# EAGLE design Lumiboard - main board (rev C) (EAGLE 6.5.0)
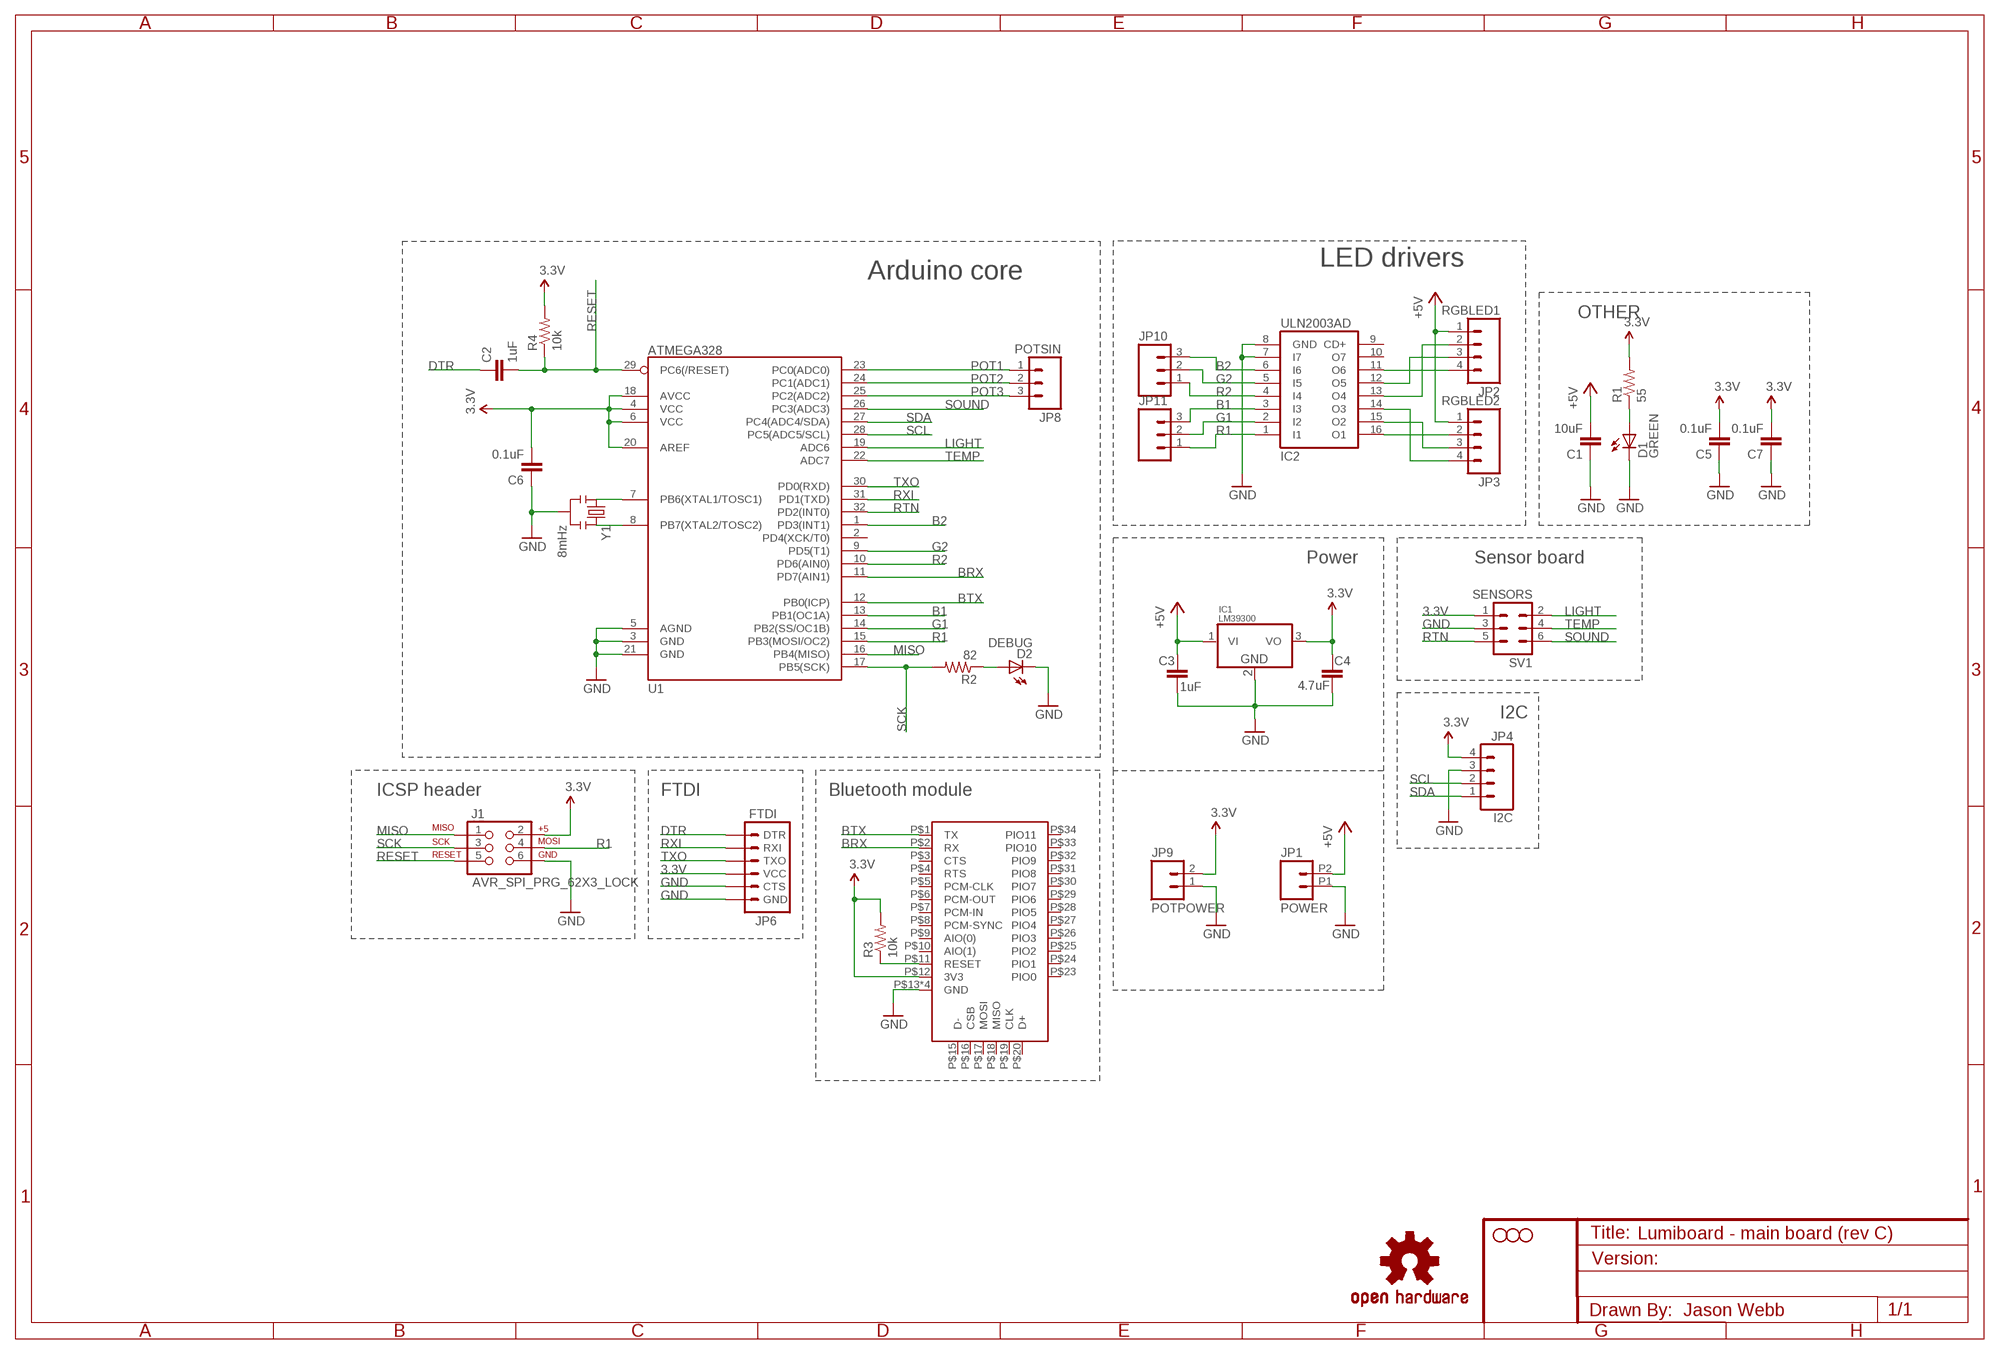
[diagram p0: schematic, sheet 1]

## Parts
C1  10uF  CAP0805  [0805]
C2  1uF  CAP0805  [0805]
C3  1uF  CAP0805  [0805]
C4  4.7uF  CAP0805  [0805]
C5  0.1uF  CAP0805  [0805]
C6  0.1uF  CAP0805  [0805]
C7  0.1uF  CAP0805  [0805]
D1  GREEN  LEDCHIPLED_0805  [CHIPLED_0805]
D2  DEBUG  LEDCHIPLED_0805  [CHIPLED_0805]
H1  STAND-OFFTIGHT  [STAND-OFF-TIGHT]
H2  STAND-OFFTIGHT  [STAND-OFF-TIGHT]
H3  STAND-OFFTIGHT  [STAND-OFF-TIGHT]
IC1  LM39300  [DPAK]
IC2  ULN2003AD  [SO16]
J1  AVR_SPI_PRG_62X3_LOCK  [2X3_LOCK]
JP1  POWER  M022.54MM_SCREWTERM  [1X02_2.54_SCREWTERM]
JP2  RGBLED1  M04PTH  [1X04]
JP3  RGBLED2  M04PTH  [1X04]
JP4  I2C  M04PTH  [1X04]
JP6  FTDI  ARDUINO_SERIAL_PROGRAMLOCK  [1X06_LOCK]
JP8  POTSIN  M03PTH  [1X03]
JP9  POTPOWER  M02PTH  [1X02]
JP10  M03PTH  [1X03]
JP11  M03PTH  [1X03]
LOGO1  OSHW-LOGOS  [OSHW-LOGO-S]
R1  55  RESISTOR0805-RES  [0805]
R2  82  RESISTOR0805-RES  [0805]
R3  10k  RESISTOR0805-RES  [0805]
R4  10k  RESISTOR0805-RES  [0805]
SV1  SENSORS  ML6  [ML6]
U1  ATMEGA328  ATMEGA168  [TQFP32-08]
U2  DX_BT_MODULE  [DXBLUETOOTHMODULE]
Y1  8mHz  RESONATORSMD  [RESONATOR-SMD]

## Nets
3.3V: C4.2 C5.2 C6.2 C7.2 IC1.3(VO) J1.2 JP4.4 JP6.4(VCC) JP9.2 R1.2 R3.2 R4.2 SV1.1 U1.4(VCC) U1.6(VCC) U1.18(AVCC) U1.20(AREF) U2.P$12(3V3)
+5V: C1.2 C3.2 IC1.1(VI) JP1.P2 JP2.1 JP3.1
B1: IC2.3(I3) JP11.3 U1.13(PB1(OC1A))
B2: IC2.6(I6) JP10.3 U1.1(PD3(INT1))
BRX: U1.11(PD7(AIN1)) U2.P$2(RX)
BTRESET: R3.1 U2.P$11(RESET)
BTX: U1.12(PB0(ICP)) U2.P$1(TX)
DTR: C2.1 JP6.1(DTR)
G1: IC2.2(I2) JP11.2 U1.14(PB2(SS/OC1B))
G2: IC2.5(I5) JP10.2 U1.9(PD5(T1))
GND: C1.1 C3.1 C4.1 C5.1 C6.1 C7.1 D1.C D2.C IC1.2(GND) IC2.7(I7) IC2.8(GND) J1.6 JP1.P1 JP4.3 JP6.5(CTS) JP6.6(GND) JP9.1 SV1.3 U1.3(GND) U1.5(AGND) U1.21(GND) U2.P$13(GND) U2.P$14(GND) U2.P$21(GND) U2.P$22(GND) Y1.2
LIGHT: SV1.2 U1.19(ADC6)
MISO: J1.1 U1.16(PB4(MISO))
N$1: IC2.16(O1) JP3.2
N$3: IC2.15(O2) JP3.3
N$4: IC2.13(O4) JP2.2
N$5: IC2.14(O3) JP3.4
N$6: IC2.12(O5) JP2.3
N$7: U1.7(PB6(XTAL1/TOSC1)) Y1.1
N$8: U1.8(PB7(XTAL2/TOSC2)) Y1.3
N$9: D1.A R1.1
N$10: IC2.11(O6) JP2.4
N$13: D2.A R2.1
POT1: JP8.1 U1.23(PC0(ADC0))
POT2: JP8.2 U1.24(PC1(ADC1))
POT3: JP8.3 U1.25(PC2(ADC2))
R1: IC2.1(I1) J1.4 JP11.1 U1.15(PB3(MOSI/OC2))
R2: IC2.4(I4) JP10.1 U1.10(PD6(AIN0))
RESET: C2.2 J1.5 R4.1 U1.29(PC6(/RESET))
RTN: SV1.5 U1.32(PD2(INT0))
RXI: JP6.2(RXI) U1.31(PD1(TXD))
SCK: J1.3 R2.2 U1.17(PB5(SCK))
SCL: JP4.2 U1.28(PC5(ADC5/SCL))
SDA: JP4.1 U1.27(PC4(ADC4/SDA))
SOUND: SV1.6 U1.26(PC3(ADC3))
TEMP: SV1.4 U1.22(ADC7)
TXO: JP6.3(TXO) U1.30(PD0(RXD))
Unconnected: IC2.9(CD+) IC2.10(O7) U1.2(PD4(XCK/T0)) U2.P$3(CTS) U2.P$4(RTS) U2.P$5(PCM-CLK) U2.P$6(PCM-OUT) U2.P$7(PCM-IN) U2.P$8(PCM-SYNC) U2.P$9(AIO(0)) U2.P$10(AIO(1)) U2.P$15(D-) U2.P$16(CSB) U2.P$17(MOSI) U2.P$18(MISO) U2.P$19(CLK) U2.P$20(D+) U2.P$23(PIO0) U2.P$24(PIO1) U2.P$25(PIO2) U2.P$26(PIO3) U2.P$27(PIO4) U2.P$28(PIO5) U2.P$29(PIO6) U2.P$30(PIO7) U2.P$31(PIO8) U2.P$32(PIO9) U2.P$33(PIO10) U2.P$34(PIO11)

## Notes on the sheet
- LED drivers
- Arduino core
- OTHER
- Power | Sensor board
- I2C
- ICSP header | FTDI | Bluetooth module
- Jason Webb

## Library data of the parts
C1-C7 = SparkFun:CAP: Capacitor Standard 0603 ceramic capacitor, and 0.1" leaded capacitor.
D1 D2 = led:LED: LED OSRAM: - CHIPLED LG R971, LG N971, LY N971, LG Q971, LY Q971, LO R971, LY R971 LH N974, LH R974 LS Q976, LO Q976, LY Q976 LO Q996 - Hyper CHIPLED LW Q18S LB Q993, LB Q99A, LB R99A - SideLED LS A670, LO A670, LY A670, LG A670, LP A670 LB A673, LV A673, LT A673, LW A673 LH A674 LY A675 LS A676, LA A676, LO A676, LY A676, LW A676 LS A679, LY A679, LG A679 - Hyper Micro SIDELED® LS Y876, LA Y876, LO Y876, LY Y876 LT Y87S - SmartLED LW L88C, LW L88S LB L89C, LB L89S, LG L890 LS L89K, LO L89K, LY L89K LS L896, LA L896, LO L896, LY L896 - TOPLED LS T670, LO T670, LY T670, LG T670, LP T670 LSG T670, LSP T670, LSY T670, LOP T670, LYG T670 LG T671, LOG T671, LSG T671 LB T673, LV T673, LT T673, LW T673 LH T674 LS T676, LA T676, LO T676, LY T676, LB T676, LH T676, LSB T676, LW T676 LB T67C, LV T67C, LT T67C, LS T67K, LO T67K, LY T67K, LW E67C LS E67B, LA E67B, LO E67B, LY E67B, LB E67C, LV E67C, LT E67C LW T67C LS T679, LY T679, LG T679 LS T770, LO T770, LY T770, LG T770, LP T770 LB T773, LV T773, LT T773, LW T773 LH T774 LS E675, LA E675, LY E675, LS T675 LS T776, LA T776, LO T776, LY T776, LB T776 LHGB T686 LT T68C, LB T68C - Hyper Mini TOPLED® LB M676 - Mini TOPLED Santana® LG M470 LS M47K, LO M47K, LY M47K Source: http://www.osram.convergy.de LUXEON: - LUMILED® LXK2-PW12-R00, LXK2-PW12-S00, LXK2-PW14-U00, LXK2-PW14-V00 LXK2-PM12-R00, LXK2-PM12-S00, LXK2-PM14-U00 LXK2-PE12-Q00, LXK2-PE12-R00, LXK2-PE12-S00, LXK2-PE14-T00, LXK2-PE14-U00 LXK2-PB12-K00, LXK2-PB12-L00, LXK2-PB12-M00, LXK2-PB14-N00, LXK2-PB14-P00, LXK2-PB14-Q00 LXK2-PR12-L00, LXK2-PR12-M00, LXK2-PR14-Q00, LXK2-PR14-R00 LXK2-PD12-Q00, LXK2-PD12-R00, LXK2-PD12-S00 LXK2-PH12-R00, LXK2-PH12-S00 LXK2-PL12-P00, LXK2-PL12-Q00, LXK2-PL12-R00 Source: www.luxeon.com KINGBRIGHT: KA-3528ASYC Source: www.kingbright.com
H1-H3 = SparkFun:STAND-OFF: Stand Off This is the mechanical footprint for a #4 phillips button head screw. Use the keepout ring to avoid running the screw head into surrounding components. SKU : PRT-00447
IC1 = LM39300:LM39300
IC2 = uln-udn:ULN2003A: DRIVER ARRAY
J1 = SparkFun-Connectors:AVR_SPI_PRG_6: AVR ISP 6 Pin This is the reduced ISP connector for AVR programming. Common on Arduino. This footprint will take up less PCB space and can be used with a 10-pin to 6-pin adapter such as SKU: BOB-08508
JP1 = SparkFun-Connectors:M02: Standard 2-pin 0.1" header. Use with - straight break away headers ( PRT-00116) - right angle break away headers (PRT-00553) - swiss pins (PRT-00743) - machine pins (PRT-00117) - female headers (PRT-00115) Molex polarized connector foot print use with: PRT-08233 with associated crimp pins and housings. 2.54_SCREWTERM for use with PRT-10571. 3.5mm Screw Terminal footprints for PRT-08084 5mm Screw Terminal footprints for use with PRT-08433
JP2-JP4 = SparkFun-Connectors:M04: Header 4 Standard 4-pin 0.1" header. Use with straight break away headers (SKU : PRT-00116), right angle break away headers (PRT-00553), swiss pins (PRT-00743), machine pins (PRT-00117), and female headers (PRT-00115). Molex polarized connector foot print use with SKU : PRT-08231 with associated crimp pins and housings. 1MM SMD Version SKU: PRT-10208
JP6 = SparkFun:ARDUINO_SERIAL_PROGRAM
JP8 = SparkFun:M03: Header 3 Standard 3-pin 0.1" header. Use with straight break away headers (SKU : PRT-00116), right angle break away headers (PRT-00553), swiss pins (PRT-00743), machine pins (PRT-00117), and female headers (PRT-00115). Molex polarized connector foot print use with SKU : PRT-08232 with associated crimp pins and housings.
JP9 = SparkFun:M02: Header 2 Standard 2-pin 0.1" header. Use with straight break away headers (SKU : PRT-00116), right angle break away headers (PRT-00553), swiss pins (PRT-00743), machine pins (PRT-00117), and female headers (PRT-00115). Molex polarized connector foot print use with SKU : PRT-08233 with associated crimp pins and housings.
JP10 JP11 = SparkFun-Connectors:M03: Header 3 Standard 3-pin 0.1" header. Use with straight break away headers (SKU : PRT-00116), right angle break away headers (PRT-00553), swiss pins (PRT-00743), machine pins (PRT-00117), and female headers (PRT-00115). Molex polarized connector foot print use with SKU : PRT-08232 with associated crimp pins and housings.
LOGO1 = SparkFun-Aesthetics:OSHW-LOGO: Open Source Hardware Logo This logo indicates the piece of hardware it is found on incorporates a OSHW license and/or adheres to the definition of open source hardware found here: http://freedomdefined.org/OSHW
R1-R4 = SparkFun-Resistors:RESISTOR: Resistor Basic schematic elements and footprints for 0603, 1206, and PTH resistors.
SV1 = con-harting-ml:ML6: HARTING; OC_FARNELL: unknown; OC_NEWARK: unknown
U1 = SparkFun:ATMEGA168
U2 = Richardson:DX_BT_MODULE: http://www.dealextreme.com/p/wireless-bluetooth-rs232-ttl-transceiver-module-80711
Y1 = SparkFun:RESONATOR: Resonator Small SMD resonator. This is the itty bitty 10/20MHz resonators with built in caps. CSTCE10M0G55 and CSTCE20M0V53. Footprint has been reviewed closely but hasn't been tested yet.

## Net classes
0 Power: width 0.254 mm, drill 0.305 mm, clearance 0.203 mm

## Board
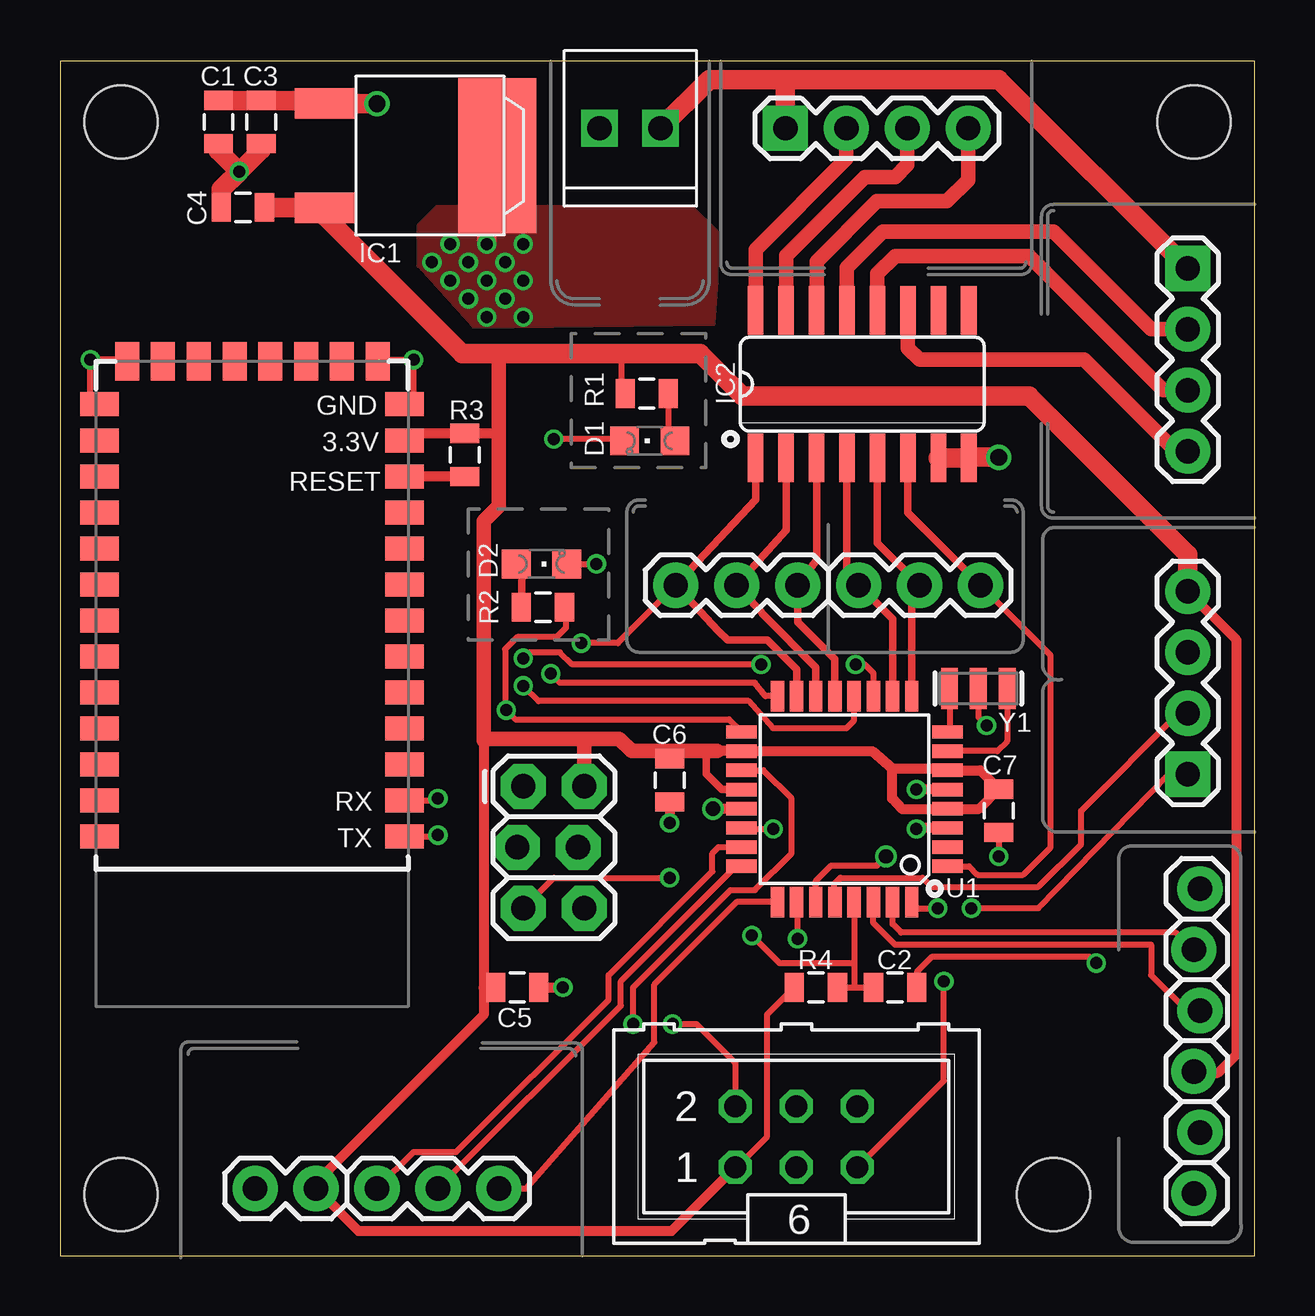
[diagram p1: board, top side]
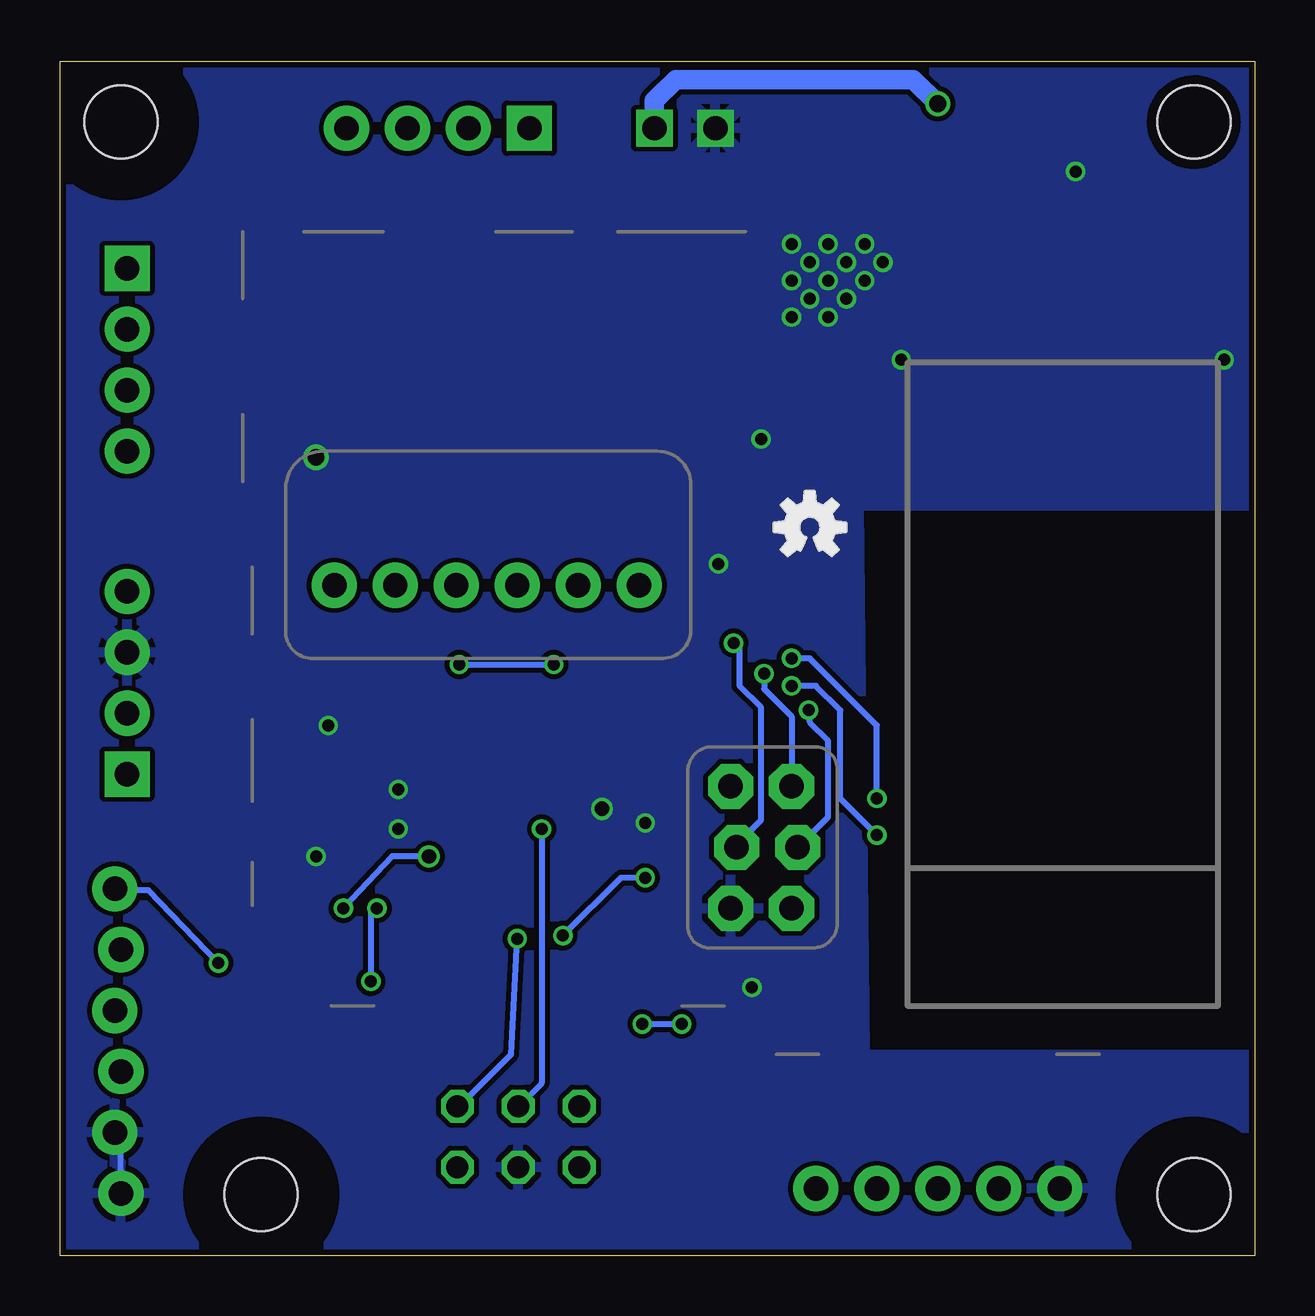
[diagram p2: board, bottom side, seen from below]

Size 49.78 x 49.78 mm. Coordinates in mm from the lower left corner, seen from the top.
Outline: 0,0 49.78,0 49.78,49.78 0,49.78 0,0
Copper layers (1*2*15*16): Top 0.035mm / dielectric 0.2mm / Route2 0.0175mm / dielectric 1.1mm / Route15 0.0175mm / dielectric 0.2mm / Bottom 0.035mm
Design rules "SeeedStudio_DRU_no_angle_20130527": minimum track width 6mil, minimum drill 12mil, track to track 6mil, track to pad 6mil, pad to pad 6mil, via to via 6mil, smd to smd 0mil, copper to edge 10mil, drill to drill 10mil, minimum pad ring 6mil, minimum via ring 6mil, stop-mask expansion 2mil, vias tented up to drill 25mil, thermal gap 10mil
tRestrict: area -0.6,-0.6 to 5.7,5.7; area 38.2,-0.6 to 44.6,5.7; area 44.1,44.1 to 50.4,50.4
bRestrict: area -0.6,-0.6 to 5.7,5.7; area 38.2,-0.6 to 44.6,5.7; area 44.1,44.1 to 50.4,50.4

### Footprints (pad centres in the part's own frame; a part is rotated, then mirrored left to right if it is on the bottom)
0805 = smd 0.8 x 1.2: 1 -0.9,0; 2 0.9,0
CHIPLED_0805 = smd 1.2 x 1.2: A 0,-1.05; C 0,1.05
STAND-OFF-TIGHT = hole 3.048: 0,0
DPAK = smd 1.27 x 2.54: 1 -2.057,-4.445; 3 2.311,-4.445 | smd 6.452 x 3.251: 2 0.127,2.718
SO16 = smd 0.66 x 2.032: 1 -4.445,-3.073; 2 -3.175,-3.073; 3 -1.905,-3.073; 4 -0.635,-3.073; 5 0.635,-3.073; 6 1.905,-3.073; 7 3.175,-3.073; 8 4.445,-3.073; 9 4.445,3.073; 10 3.175,3.073; 11 1.905,3.073; 12 0.635,3.073; 13 -0.635,3.073; 14 -1.905,3.073; 15 -3.175,3.073; 16 -4.445,3.073
2X3_LOCK = drill 1.016 pad 1.88 octagon: 1 0,0; 2 0,2.54; 3 2.54,-0.254; 4 2.54,2.286; 5 5.08,0; 6 5.08,2.54
1X02_2.54_SCREWTERM = drill 1.016 square: P1 2.54,0; P2 0,0
1X04 = drill 1.016 pad 1.88 square: 1 0,0 | drill 1.016 pad 1.88: 2 2.54,0; 3 5.08,0; 4 7.62,0
1X06_LOCK = drill 1.016 pad 1.88: 1 0,0; 2 2.54,-0.254; 3 5.08,0; 4 7.62,-0.254; 5 10.16,0; 6 12.7,-0.254
1X03 = drill 1.016 pad 1.88: 1 0,0; 2 2.54,0; 3 5.08,0
1X02 = drill 1.016 pad 1.88: 1 0,0; 2 2.54,0
ML6 = drill 0.914 octagon: 1 -2.54,-1.27; 2 -2.54,1.27; 3 0,-1.27; 4 0,1.27; 5 2.54,-1.27; 6 2.54,1.27
TQFP32-08 = smd 1.27 x 0.559: 1 -4.293,2.8; 2 -4.293,2; 3 -4.293,1.2; 4 -4.293,0.4; 5 -4.293,-0.4; 6 -4.293,-1.2; 7 -4.293,-2; 8 -4.293,-2.8; 17 4.293,-2.8; 18 4.293,-2; 19 4.293,-1.2; 20 4.293,-0.4; 21 4.293,0.4; 22 4.293,1.2; 23 4.293,2; 24 4.293,2.8 | smd 0.559 x 1.27: 9 -2.8,-4.293; 10 -2,-4.293; 11 -1.2,-4.293; 12 -0.4,-4.293; 13 0.4,-4.293; 14 1.2,-4.293; 15 2,-4.293; 16 2.8,-4.293; 25 2.8,4.293; 26 2,4.293; 27 1.2,4.293; 28 0.4,4.293; 29 -0.4,4.293; 30 -1.2,4.293; 31 -2,4.293; 32 -2.8,4.293
DXBLUETOOTHMODULE = smd 1.6 x 1: P$1 -6.35,6.35; P$2 -6.35,4.85; P$3 -6.35,3.35; P$4 -6.35,1.85; P$5 -6.35,0.35; P$6 -6.35,-1.15; P$7 -6.35,-2.65; P$8 -6.35,-4.15; P$9 -6.35,-5.65; P$10 -6.35,-7.15; P$11 -6.35,-8.65; P$12 -6.35,-10.15; P$13 -6.35,-11.66; P$22 6.35,-11.66; P$23 6.35,-10.15; P$24 6.35,-8.65; P$25 6.35,-7.15; P$26 6.35,-5.65; P$27 6.35,-4.15; P$28 6.35,-2.65; P$29 6.35,-1.15; P$30 6.35,0.35; P$31 6.35,1.85; P$32 6.35,3.35; P$33 6.35,4.85; P$34 6.35,6.35 | smd 1 x 1.6: P$14 -5.23,-13.45; P$15 -3.74,-13.45; P$16 -2.25,-13.45; P$17 -0.76,-13.45; P$18 0.73,-13.45; P$19 2.22,-13.45; P$20 3.71,-13.45; P$21 5.2,-13.45
RESONATOR-SMD = smd 0.7 x 1.7: 1 -1.2,0; 2 0,0; 3 1.2,0

### Placement (x,y rotation side)
C1  6.6,47.24 90 top
C2  34.8,11.18 180 top
C3  8.38,47.24 90 top
C4  7.62,43.69 0 top
C5  19.05,11.18 180 top
C6  25.4,19.81 90 top
C7  39.12,18.54 90 top
D1  24.57,33.96 90 top
D2  20.07,28.83 270 top
H1  2.54,47.24 0 top
H2  2.54,2.54 0 top
H3  41.4,2.54 0 top
H4  STAND-OFFTIGHT  [STAND-OFF-TIGHT]  47.24,47.24 0 top
IC1  15.49,45.97 270 top
IC2  33.43,36.32 0 top
J1  19.3,19.56 270 top
JP1  25.02,46.99 180 top
JP2  46.99,41.15 270 top
JP3  30.23,46.99 0 top
JP4  46.99,20.07 90 top
JP6  47.5,15.29 270 top
JP8  13.21,2.79 0 top
JP9  8.13,2.79 0 top
JP10  33.27,27.94 0 top
JP11  25.65,27.94 0 top
LOGO1  18.54,30.35 0 bottom
R1  24.45,35.93 180 top
R2  20.12,27.03 0 top
R3  16.87,33.38 90 top
R4  31.5,11.18 180 top
SV1  30.68,4.95 0 top
U1  32.69,19.02 180 top
U2  8,23.83 180 top
Y1  38.27,23.63 180 top

### Tracks (layer width: path | path; a pad name or v marks a point on that pad's centre or on a via)
3.3V
  Top 0.254: R1.2 23.41,36.07 23.41,37.59 23.62,37.59 | SV1.1 28.19,3.68 29.46,4.95 29.46,10.04 R4.2 30.61,11.16
  Top 0.305: U1.20 27.57,19.43 26.92,20.07 26.92,21.02
  Top 0.406: R1.2 23.38,35.93 | JP6.4 47.3,7.62 48.26,7.62 49.02,8.38 49.02,25.65 JP4.4 | 17.65,21.46 17.65,11.18 | 17.65,11.18 17.65,10.03 10.67,3.05 JP9.2 12.45,1.02 25.48,1.02 SV1.1 | 27.39,21.02 U1.18 33.84,21.02 34.67,20.3 | C7.2 38.3,18.62 U1.4 36.91,18.57 36.87,18.6 35.1,18.6 34.67,19.05 34.67,20.3 | U1.6 38.33,20.23 C7.2 | 39.13,19.46 C7.2 | 34.67,20.3 37.08,20.3 | 18.29,34.04 18.05,34.28 R3.2 14.65,34.28 U2.P$12 | C5.2 17.65,11.18
  Top 0.61: 17.65,21.53 17.65,30.61 18.29,31.24 18.29,34.04 18.29,37.59 18.54,37.59 | 17.65,21.46 17.65,21.53 | 17.65,21.53 21.84,21.53 | 21.84,21.53 23.31,21.53 23.82,21.02 25.4,21.02 | J1.2 21.84,21.53 | 25.4,21.02 26.92,21.02 27.39,21.02 | C6.2 25.4,21.02
  Top 0.813: JP4.4 46.99,29.21 40.39,35.81 28.45,35.81 26.67,37.59 23.62,37.59 18.54,37.59 16.76,37.59 11.05,43.31 IC1.3 10.77,43.69 C4.2
+5V  (via drill 0.7)
  Top 0.813: JP2.1 39.12,49.02 30.23,49.02 | C1.2 C3.2 10.68,48.14 IC1.1 11.02,48.01 | JP3.1 30.23,49.02 | JP1.P2 27.05,49.02 30.23,49.02 | 10.92,47.9 11.02,48.01 | 11.02,48.01 v13.21,48.01
  Bottom 0.813: JP1.P2 25.02,48.13 24.13,49.02 14.22,49.02 v13.21,48.01
B1
  Top 0.305: IC2.3 31.52,28.98 JP11.3 30.73,26.42 32.29,24.86 U1.13
B2
  Top 0.254: U1.1 37.88,16.23 38.23,15.88 40.13,15.88 41.27,17.02 41.27,25.02 JP10.3
  Top 0.305: 36.83,16.26 U1.1 | JP10.3 35.33,30.96 IC2.6
BRX  (via drill 0.5 pad 0.38)
  Top 0.254: 33.78,23.37 33.85,23.3 | 33.85,23.3 33.91,23.24 | v29.21,24.64 21.34,24.64 20.83,25.15 19.56,25.15 v19.3,24.89 | 33.85,23.3 33.86,23.32 U1.11 33.89,24.28 33.53,24.64 v33.15,24.64 | U2.P$2 15.75,18.98 v15.75,19.05
  Bottom 0.254: v33.15,24.64 v29.21,24.64 | v19.3,24.89 18.54,24.89 15.75,22.1 v15.75,19.05
BTRESET
  Top 0.406: R3.1 U2.P$11
BTX  (via drill 0.5, 0.5 pad 0.38)
  Top 0.254: U1.12 33.02,23.11 33.07,23.06 33.07,22.28 32.77,21.97 29.72,21.97 28.7,23.11 19.94,23.11 v19.3,23.75 | U2.P$1 15.75,17.48 v15.75,17.53
  Bottom 0.254: v19.3,23.75 18.29,23.75 17.27,22.73 17.27,19.05 v15.75,17.53
DTR  (via drill 0.5)
  Top 0.254: 35.69,11.19 C2.1 35.7,11.82 36.32,12.45 42.93,12.45 v43.18,12.19
  Bottom 0.254: JP6.1 47.45,15.24 46.1,15.24 v43.18,12.19
G1
  Top 0.305: IC2.2 30.25,30.25 JP11.2 29.34,26.67 31.49,24.52 U1.14
G2
  Top 0.305: IC2.5 34.06,29.69 JP10.2 35.49,27.62 U1.9
GND  (via drill 0.5, 0.5 pad 0.38, 0.6 pad 0.38, 0.7)  (1 unrouted)
  Top 0.254: Y1.2 38.27,22.44 v38.61,22.1 | 37.08,17.78 U1.3 | D1.C 23.45,34.04 v20.57,34.04 | 20.83,29.12 D2.C v22.35,28.83 | C7.1 v39.12,16.64 | U2.P$21 2.74,37.34 v1.27,37.34 1.27,35.87 U2.P$22 | 13.29,37.34 v14.73,37.34 14.73,35.87 U2.P$13
  Top 0.406: U1.21 27.36,18.62 v27.2,18.62 | U1.3 35.73,17.82 v35.69,17.78 | U1.5 v35.69,19.43 | C6.1 v25.4,18.03 | C5.1 v20.95,11.18
  Top 0.813: v17.78,42.16 17.83,45.97 IC1.2 | C4.1 6.72,44.44 v7.47,45.19 | C1.1 6.6,46.05 v7.47,45.19 | C3.1 8.38,46.1 v7.47,45.19 | IC2.7 IC2.8 37.9,33.27 v39.12,33.27
  Bottom 0.254: JP6.6 47.24,4.88 JP6.5
  other vias: 19.3,42.16 19.3,40.64 18.54,41.4 17.78,40.64 17.02,41.4 16.26,42.16 15.49,41.4 16.26,40.64 17.02,39.88 18.54,39.88 17.78,39.12 19.3,39.12
  pour Bottom: -0.25,-0.25 50.04,-0.25 50.04,50.04 -0.25,50.04 -0.25,31.24 16.51,31.24 16.26,8.38 -0.51,8.38
  pour Top (no thermals): 15.75,43.69 26.29,43.69 27.3,42.67 27.3,40.64 27.18,38.86 17.27,38.73 14.99,41.27 14.99,42.93
  pour Bottom (no thermals): 46.86,25.15 46.1,25.91 46.23,26.04 46.35,26.04 48.13,24.26 48.01,24.13 47.88,24.13 46.99,25.02
  pour Bottom (no thermals): 47.88,25.91 46.1,24.13 45.97,24.26 45.97,24.38 47.75,26.16 47.88,26.04
  pour Bottom (no thermals): 22.23,46.99 21.46,47.75 21.59,47.88 21.72,47.88 23.5,46.1 23.37,45.97 23.24,45.97 22.35,46.86
  pour Bottom (no thermals): 23.5,47.75 21.72,45.97 21.59,46.1 21.59,46.23 23.37,48.01 23.5,47.88
LIGHT  (via drill 0.5 pad 0.38)
  Top 0.254: U1.19 29.3,20.23 30.48,19.05 30.48,16.76 28.96,15.24 27.94,15.24 23.88,11.18 v23.88,9.65 | v25.53,9.65 26.52,9.65 28.14,8.03 SV1.2
  Bottom 0.254: v25.53,9.65 v23.88,9.65
MISO  (via drill 0.5 pad 0.38)
  Top 0.254: U1.16 29.39,23.32 28.96,23.88 20.83,23.88 v20.45,24.26
  Bottom 0.254: v20.45,24.26 20.45,23.62 19.3,22.48 J1.1
N$1
  Top 0.61: IC2.16 28.98,41.94 32.77,45.72 JP3.2
N$3
  Top 0.61: IC2.15 30.25,41.68 33.53,44.96 34.8,44.96 35.31,45.47 JP3.3
N$4
  Top 0.61: IC2.13 32.79,41.17 34.29,42.67 41.4,42.67 45.47,38.61 JP2.2
N$5
  Top 0.61: IC2.14 31.52,41.43 34.04,43.94 36.96,43.94 37.85,44.83 JP3.4
N$6
  Top 0.61: IC2.12 34.06,40.92 34.8,41.66 40.39,41.66 45.97,36.07 JP2.3
N$7
  Top 0.254: Y1.1 39.47,21.43 39.06,21.02 U1.7
N$8
  Top 0.254: Y1.3 37.06,21.91 U1.8
N$9
  Top 0.254: R1.1 25.35,34.24 D1.A
N$10
  Top 0.61: IC2.11 35.33,37.82 35.81,37.34 42.67,37.34 46.48,33.53 JP2.4
N$13
  Top 0.305: R2.1 19.27,28.58 D2.A
POT1
  Top 0.254: JP8.1 14.73,4.32 16.51,4.32 22.86,10.67 22.86,11.68 27.18,16 27.18,16.76 27.44,17.02 U1.23
POT2
  Top 0.254: JP8.2 23.37,10.41 23.37,11.43 28.16,16.23 U1.24
POT3
  Top 0.254: JP8.3 19.43,2.79 24.77,8.89 24.77,11.3 28.19,14.73 U1.25
R1  (via drill 0.5 pad 0.38)
  Top 0.254: JP11.1 23.24,25.53 v21.72,25.53
  Top 0.305: IC2.1 28.98,31.52 JP11.1 27.43,26.04 27.81,25.65 29.46,25.65 30.69,24.43 U1.15
  Bottom 0.254: J1.4 21.59,17.14 20.57,18.16 20.57,22.86 21.46,23.75 21.46,25.27 v21.72,25.53
R2
  Top 0.305: IC2.4 32.79,28.42 JP10.1 34.69,26.52 U1.10
RESET  (via drill 0.5)
  Top 0.254: 33.09,11.18 R4.1 32.26,11.31 | 33.09,11.18 C2.2 33.85,11.22 | J1.5 20.57,15.75 v25.4,15.75 | U1.29 33.09,12.19 | 33.09,12.19 33.09,11.18 | v28.83,13.34 29.97,12.19 33.09,12.19
  Bottom 0.254: v25.4,15.75 26.42,15.75 v28.83,13.34
RTN  (via drill 0.5)
  Top 0.254: U1.32 35.74,14.48 v36.58,14.48 | SV1.5 36.83,7.29 v36.83,11.43
  Bottom 0.254: v36.58,14.48 36.83,14.22 v36.83,11.43
RXI
  Top 0.254: U1.31 34.69,13.82 35.05,13.46 46.48,13.46 JP6.2
SCK  (via drill 0.5)
  Top 0.254: R2.2 21.08,26.92 21.08,26.16 20.7,25.78 19.05,25.78 18.54,25.27 18.54,22.78 v18.59,22.73 18.97,22.35 27.87,22.35 U1.17 | 28.19,21.84 U1.17 | 28.38,21.84 U1.17
  Bottom 0.254: J1.3 17.78,18.29 17.78,21.46 18.54,22.23 18.54,22.68 v18.59,22.73
SCL
  Top 0.254: U1.28 32.26,14.76 32.26,15.49 32.51,15.75 35.94,15.75 36.32,15.37 40.77,15.37 42.55,17.14 42.55,18.54 46.61,22.61 JP4.2
  Top 0.305: 32.26,14.73 U1.28
SDA  (via drill 0.5, 0.6 pad 0)
  Top 0.254: U1.27 31.5,15.62 32.13,16.26 34.04,16.26 v34.42,16.64 | JP4.1 46.23,20.07 40.77,14.48 v37.97,14.48
  Top 0.305: U1.27
  Bottom 0.254: v34.42,16.64 35.94,16.64 v37.97,14.48
SOUND  (via drill 0.5)
  Top 0.254: v30.73,13.21 30.73,14.73 U1.26
  Bottom 0.254: v30.73,13.21 30.99,8.38 33.02,6.35 SV1.6
TEMP  (via drill 0.5)
  Top 0.254: U1.22 28.45,17.78 v29.72,17.78
  Bottom 0.254: v29.72,17.78 29.72,7.19 SV1.4
TXO
  Top 0.254: 47.45,10.21 JP6.3 46.94,10.21 45.47,11.68 45.47,12.95 34.8,12.95 33.89,13.86 U1.30

### Text on the board
tPlace: GND | 3.3V | RESET | RX | TX
Reference: Power in | RGB LED 1 | Size: 1.96x1.96" / SMT placements: 12 / SMT component pads: 24 / SMT IC pads: 48 / PTH placements: 7 / PTH holes: 37 | RGB LED 2 | I2C interface | FTDI interface (3.3V) | J.Webb / S.Koch | Potentiometers | Sensor board
tDocu: - | + | +5V | R | G | B | REV C | POWER | LED1 | +5V | IN | POWER | R | ULN2003 | G | LED2 | B | LED1 | (RAW PWM) | LED2 | R | G | B | R | G | B | 3.3V | 11 | 10 | 9 | 6 | 5 | 3 | GND | A5 | SCL | ICSP | MISO | 3.3V | A4 | SDA | SCK | MOSI | RST | GND | GRN | FTDI (3.3V) | POTS/INPUT | GND | 3.3V | A0 | A1 | A2 | BLK
bDocu: - | + | +5V | R | G | B | Designed by Jason Webb | http://jason-webb.info | LED1 | +5V | LED2 | Each LED pin can sink / up to 500mA. | R | Common anode LEDs only! | G | B | (RAW PWM) | R | G | B | R | G | B | OSHW | SDA | 11 | 10 | 9 | 6 | 5 | 3 | I2C | SCL | ICSP | GND | 3.3V | Use HC-05, HC-06 or HM-10 | Bluetooth transceiver | DTR | FTDI (3.3V) | RXI | SENSOR MODULE | TXO | A7 | POTS/INPUT | A3 | A6 | 3V3 | GND | 3.3V | A0 | A1 | A2 | CTS | 3.3V | D2 | GND | GND